# Altium schematic sheet FMC_Clocks.SchDoc
size A4; DocumentNumber: 27; SheetNumber: 27; SheetTotal: 30
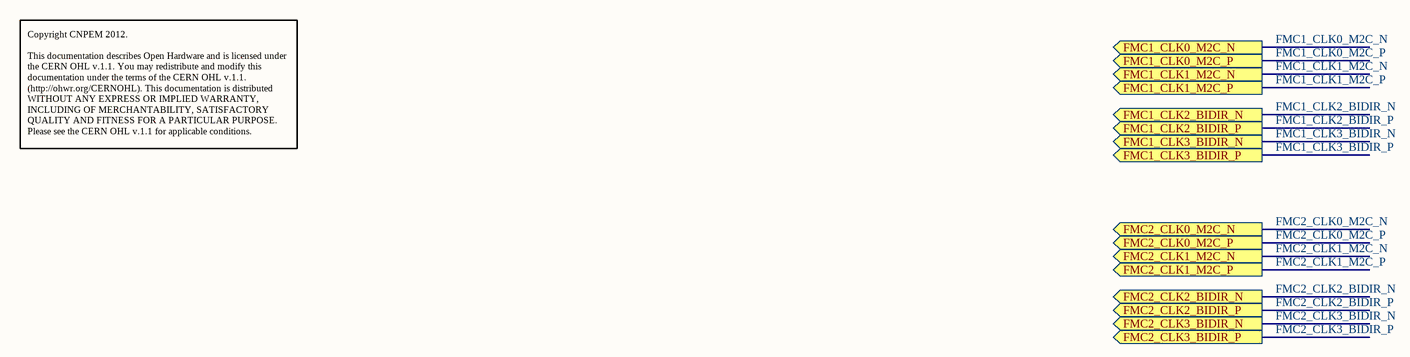
[diagram p0: FMC_Clocks.SchDoc]

## Ports
FMC1_CLK0_M2C_N (out), FMC1_CLK0_M2C_P (out), FMC1_CLK1_M2C_N (out), FMC1_CLK1_M2C_P (out), FMC1_CLK2_BIDIR_N (out), FMC1_CLK2_BIDIR_P (out), FMC1_CLK3_BIDIR_N (out), FMC1_CLK3_BIDIR_P (out), FMC2_CLK0_M2C_N (out), FMC2_CLK0_M2C_P (out), FMC2_CLK1_M2C_N (out), FMC2_CLK1_M2C_P (out), FMC2_CLK2_BIDIR_N (out), FMC2_CLK2_BIDIR_P (out), FMC2_CLK3_BIDIR_N (out), FMC2_CLK3_BIDIR_P (out)

## Nets
FMC1_CLK0_M2C_N: port FMC1_CLK0_M2C_N
FMC1_CLK0_M2C_P: port FMC1_CLK0_M2C_P
FMC1_CLK1_M2C_N: port FMC1_CLK1_M2C_N
FMC1_CLK1_M2C_P: port FMC1_CLK1_M2C_P
FMC1_CLK2_BIDIR_N: port FMC1_CLK2_BIDIR_N
FMC1_CLK2_BIDIR_P: port FMC1_CLK2_BIDIR_P
FMC1_CLK3_BIDIR_N: port FMC1_CLK3_BIDIR_N
FMC1_CLK3_BIDIR_P: port FMC1_CLK3_BIDIR_P
FMC2_CLK0_M2C_N: port FMC2_CLK0_M2C_N
FMC2_CLK0_M2C_P: port FMC2_CLK0_M2C_P
FMC2_CLK1_M2C_N: port FMC2_CLK1_M2C_N
FMC2_CLK1_M2C_P: port FMC2_CLK1_M2C_P
FMC2_CLK2_BIDIR_N: port FMC2_CLK2_BIDIR_N
FMC2_CLK2_BIDIR_P: port FMC2_CLK2_BIDIR_P
FMC2_CLK3_BIDIR_N: port FMC2_CLK3_BIDIR_N
FMC2_CLK3_BIDIR_P: port FMC2_CLK3_BIDIR_P

## Notes on the sheet
- Copyright CNPEM 2012.
  This documentation describes Open Hardware and is licensed under the CERN OHL v.1.1. You may redistribute and modify this documentation under the terms of the CERN OHL v.1.1. (http://ohwr.org/CERNOHL). This documentation is distributed WITHOUT ANY EXPRESS OR IMPLIED WARRANTY, INCLUDING OF MERCHANTABILITY, SATISFACTORY QUALITY AND FITNESS FOR A PARTICULAR PURPOSE. Please see the CERN OHL v.1.1 for applicable conditions.